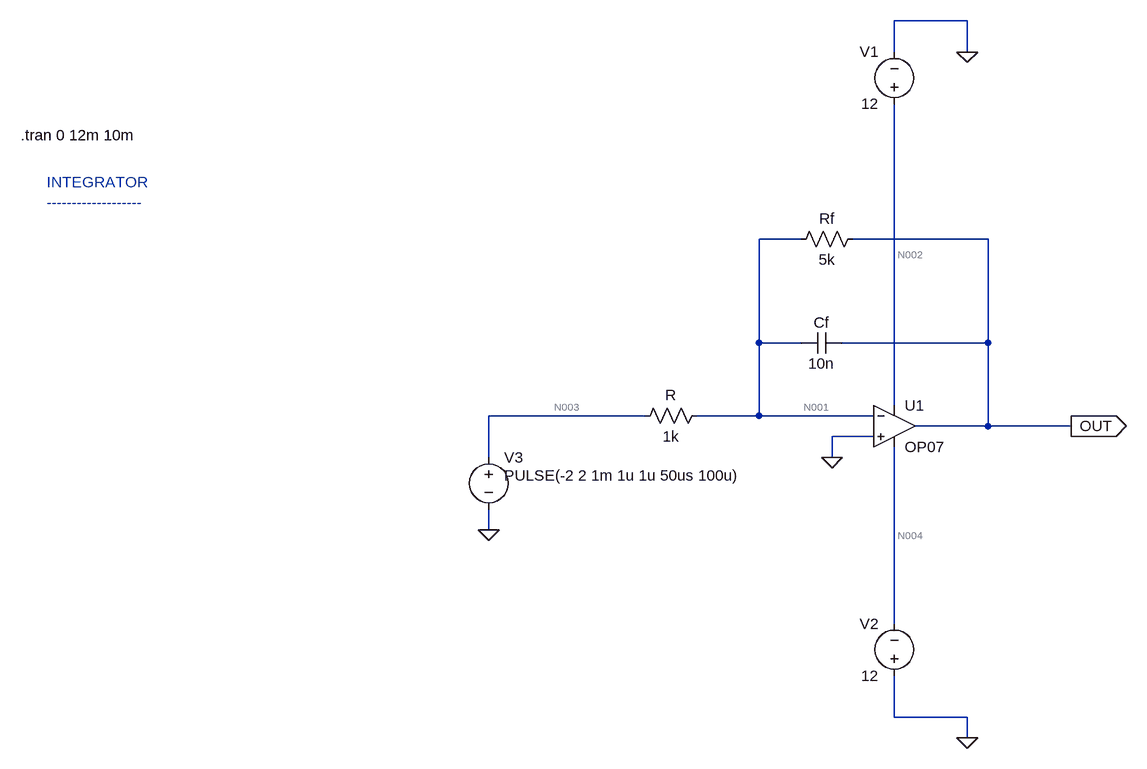
[diagram p0: schematic Op_amp_as_INTEGRATOR_triangular_wave_generator.asc]
Op_amp_as_INTEGRATOR_triangular_wave_generator.asc, the LTspice schematic file:
Version 4.1
SHEET 1 3496 1680
WIRE 192 -544 80 -544
WIRE 80 -496 80 -544
WIRE 192 -496 192 -544
WIRE -64 -208 -128 -208
WIRE 224 -208 16 -208
WIRE -128 -48 -128 -208
WIRE -64 -48 -128 -48
WIRE 224 -48 224 -208
WIRE 224 -48 0 -48
WIRE 80 48 80 -416
WIRE -304 64 -544 64
WIRE -128 64 -128 -48
WIRE -128 64 -224 64
WIRE 48 64 -128 64
WIRE 224 80 224 -48
WIRE 224 80 112 80
WIRE 352 80 224 80
WIRE 48 96 -16 96
WIRE -544 128 -544 64
WIRE -16 128 -16 96
WIRE -544 240 -544 208
WIRE 80 384 80 112
WIRE 80 528 80 464
WIRE 192 528 80 528
WIRE 192 560 192 528
FLAG 192 -496 0
FLAG 192 560 0
FLAG -544 240 0
FLAG 352 80 OUT
IOPIN 352 80 Out
FLAG -16 128 0
SYMBOL voltage 80 -400 R180
WINDOW 0 24 96 Left 2
WINDOW 3 24 16 Left 2
WINDOW 123 0 0 Left 0
WINDOW 39 0 0 Left 0
SYMATTR InstName V1
SYMATTR Value 12
SYMBOL voltage 80 480 R180
WINDOW 0 24 96 Left 2
WINDOW 3 24 16 Left 2
WINDOW 123 0 0 Left 0
WINDOW 39 0 0 Left 0
SYMATTR InstName V2
SYMATTR Value 12
SYMBOL OpAmps\\OP07 80 16 R0
SYMATTR InstName U1
SYMBOL res -208 48 R90
WINDOW 0 0 56 VBottom 2
WINDOW 3 32 56 VTop 2
SYMATTR InstName R
SYMATTR Value 1k
SYMBOL voltage -544 112 R0
WINDOW 123 0 0 Left 0
WINDOW 39 0 0 Left 0
WINDOW 3 24 44 Left 2
SYMATTR Value PULSE(-2 2 1m 1u 1u 50us 100u)
SYMATTR InstName V3
SYMBOL cap 0 -64 R90
WINDOW 0 0 32 VBottom 2
WINDOW 3 32 32 VTop 2
SYMATTR InstName Cf
SYMATTR Value 10n
SYMBOL res 32 -224 R90
WINDOW 0 0 56 VBottom 2
WINDOW 3 32 56 VTop 2
SYMATTR InstName Rf
SYMATTR Value 5k
TEXT -1264 -368 Left 2 !.tran 0 12m 10m
TEXT -1224 -296 Left 2 ;INTEGRATOR\n-------------------

The netlist it stands for:
* Op_amp_as_INTEGRATOR_triangular_wave_generator.asc
V1 N002 0 12
V2 0 N004 12
X§U1 0 N001 N002 N004 OUT LT1001  ; OP07, pins In+ In- V+ V- OUT
R N001 N003 1k
V3 N003 0 PULSE(-2 2 1m 1u 1u 50us 100u)
Cf OUT N001 10n
Rf OUT N001 5k
.tran 0 12m 10m
* INTEGRATOR
* -------------------
.lib LTC.lib
.backanno
.end

* Results of the author's LTspice run, read from the files saved beside the schematic
* Operating Point, zero values left out:
*   V(n004) = -12 V
*   V(out) = 10 V
*   V(n003) = -2 V
*   V(n002) = 12 V
*   V(n001) = -13.49 µV
*   I(V1) = -3.361 mA
*   I(Rf) = 2 mA
*   I(V3) = 2 mA
*   I(V2) = -1.361 mA
*   I(R) = 2 mA
*   Ix(u1:3) = 3.361 mA
*   Ix(u1:4) = -1.361 mA
*   Ix(u1:5) = -2 mA
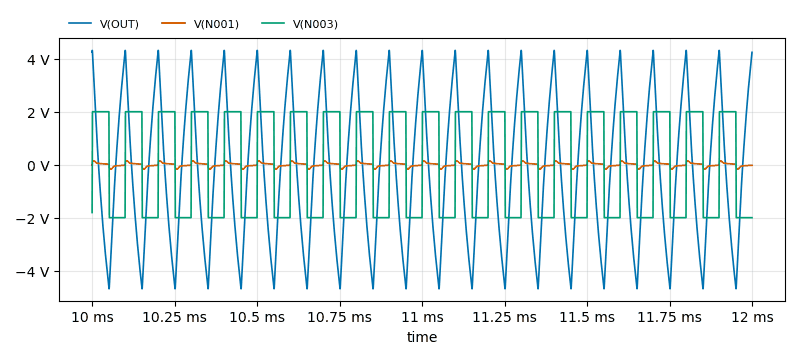
[diagram p1: Transient Analysis of Op_amp_as_INTEGRATOR_triangular_wave_generator.asc, plotted from the saved traces]
* Transient Analysis, 1 run:
*   V(OUT): min -4.687 V, max 4.317 V, average -219.1 mV, rms 2.727 V, last 4.244 V
*   V(N001): min -171.7 mV, max 147.8 mV, average -3.152 mV, rms 74.36 mV, last -22.66 mV
*   V(N003): min -2 V, max 2 V, average 40.05 mV, rms 1.987 V, last -2 V